# Altium schematic sheet final_sensor_sch_v3.SchDoc
size A2
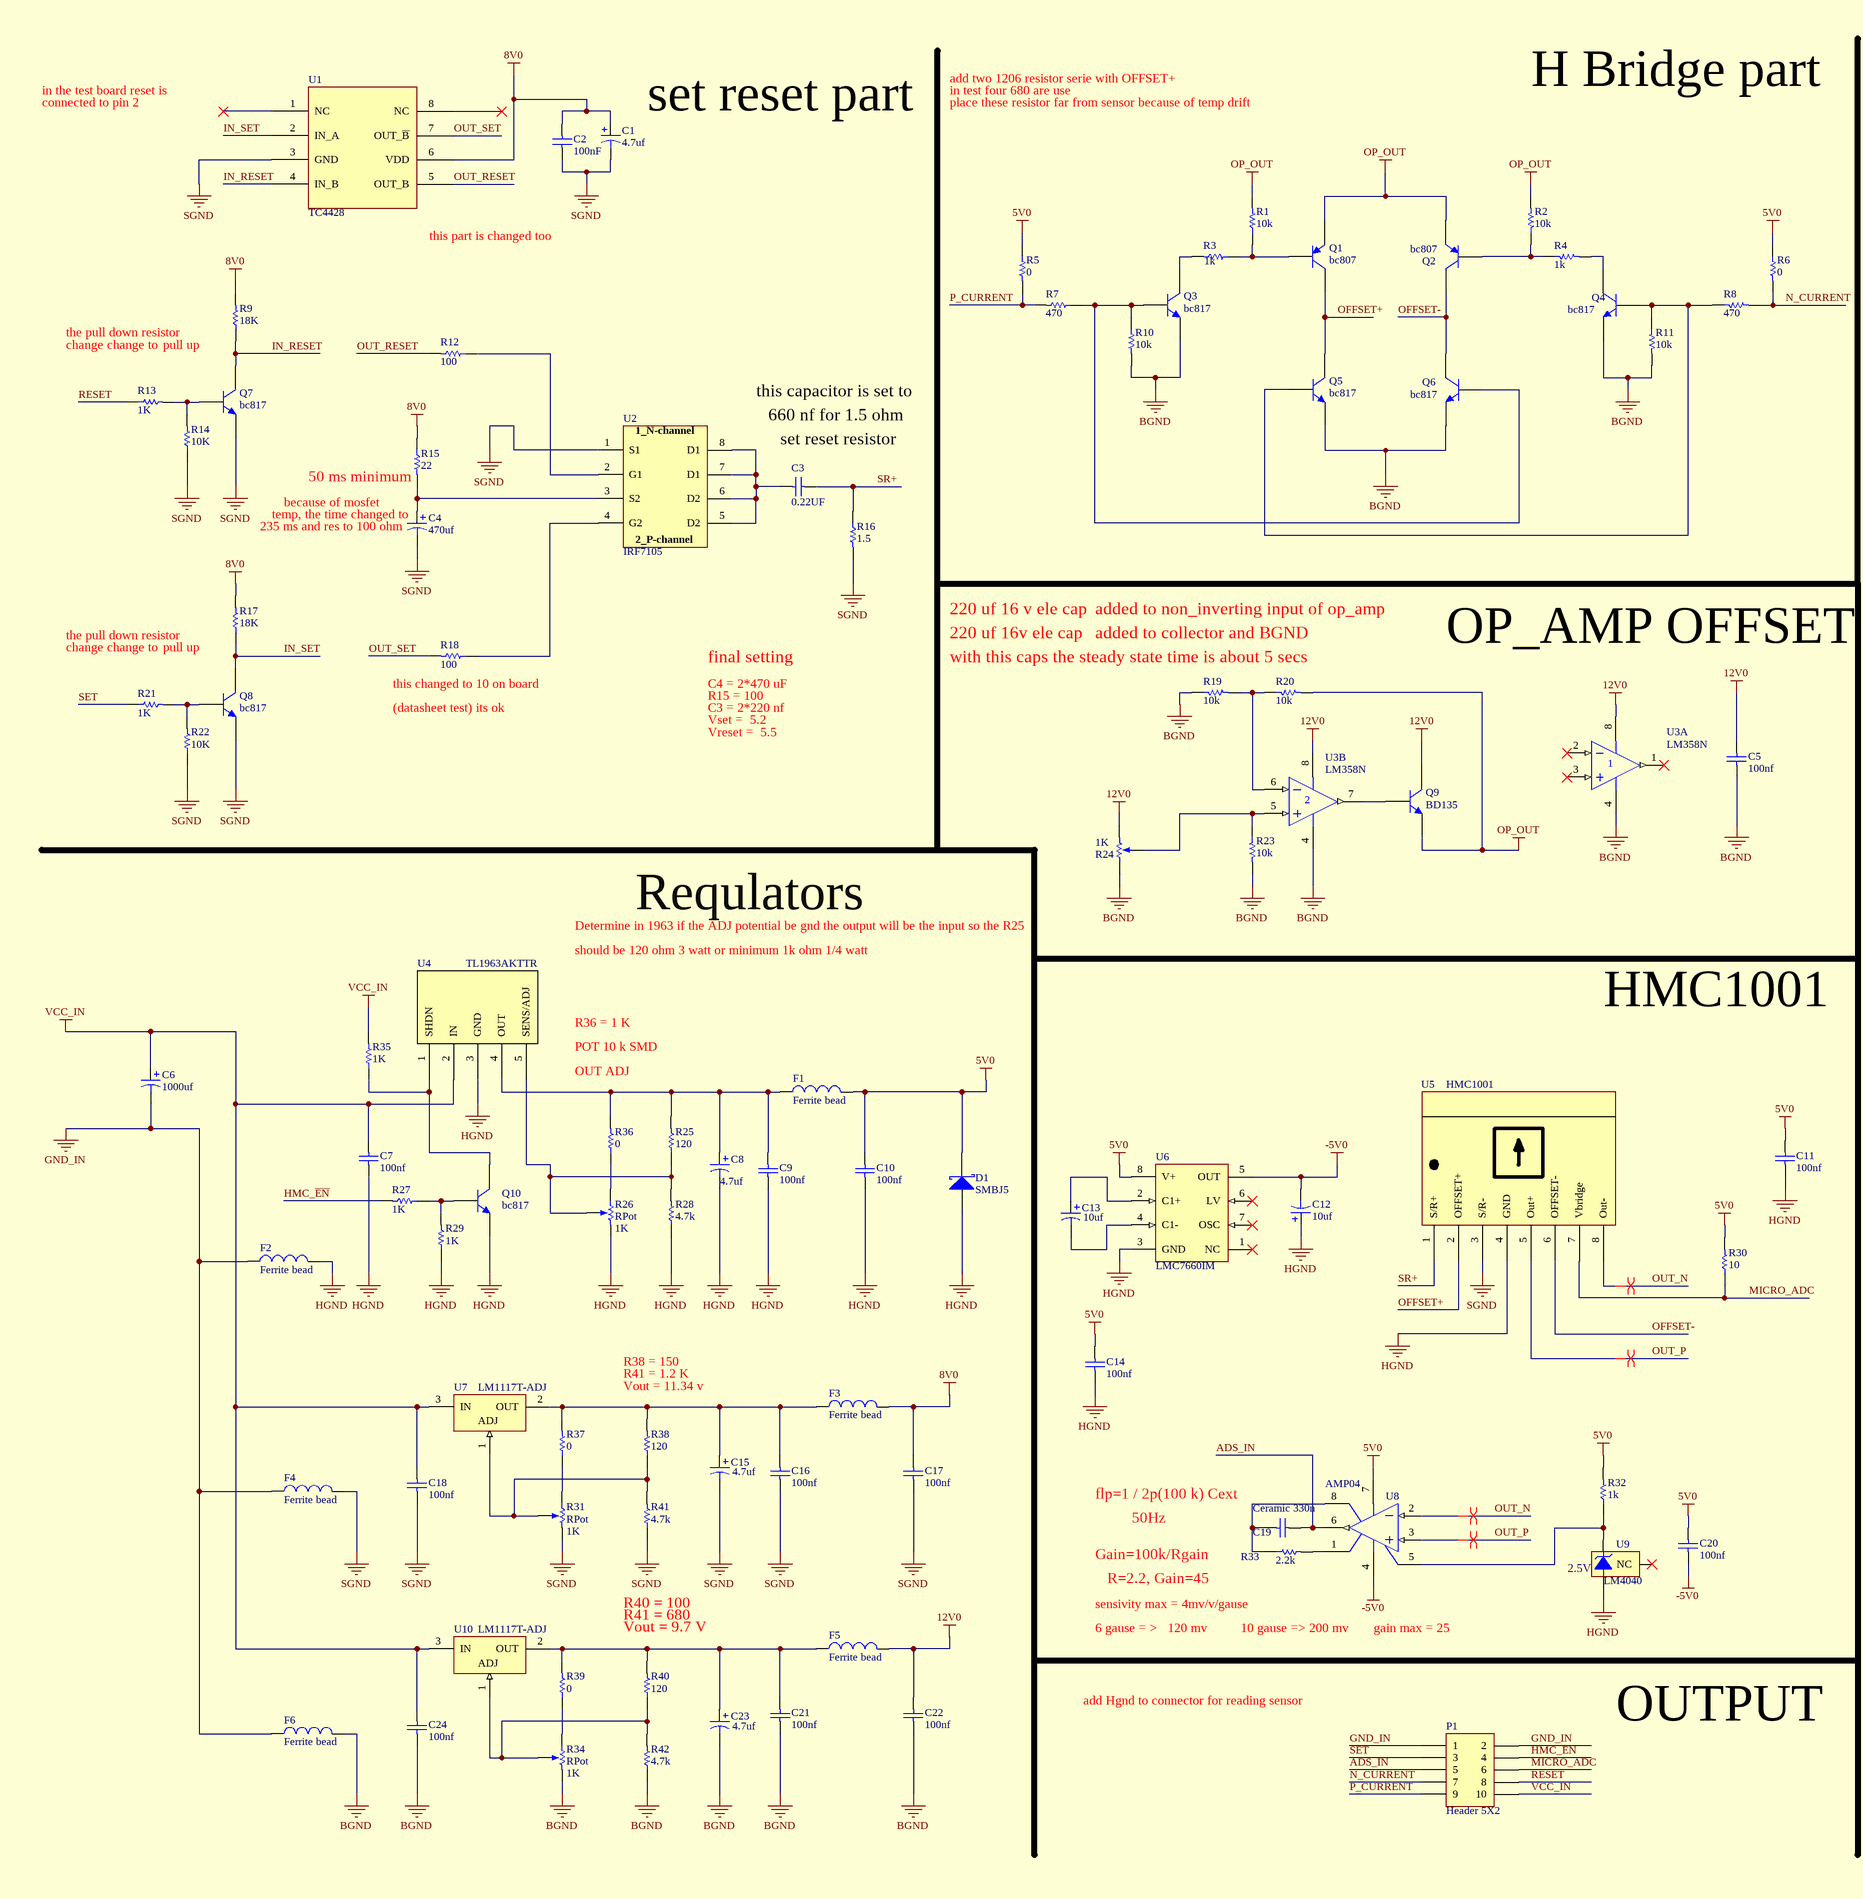
[diagram p0: final_sensor_sch_v3.SchDoc, left]
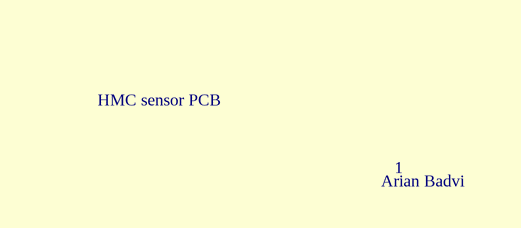
[diagram p1: final_sensor_sch_v3.SchDoc, right]

## Parts
C1  4.7uf  [cap_smd_a]
C2  100nF  [1206]
C3  0.22UF  [1206]
C4  470uf  [cap_smd_d]
C5  100nf  [1206]
C6  1000uf  [c_cyl_smd]
C7  100nf  [1206]
C8  4.7uf  [cap_smd_a]
C9  100nf  [1206]
C10  100nf  [1206]
C11  100nf  [1206]
C12  10uf  [cap_smd_a]
C13  10uf  [cap_smd_a]
C14  100nf  [1206]
C15  4.7uf  [cap_smd_a]
C16  100nf  [1206]
C17  100nf  [1206]
C18  100nf  [1206]
C19  Ceramic 330n  [1206]
C20  100nf  [1206]
C21  100nf  [1206]
C22  100nf  [1206]
C23  4.7uf  [cap_smd_a]
C24  100nf  [1206]
D1  SMBJ5  [tvs]
F1  Ferrite bead  [1206]
F2  Ferrite bead  [1206]
F3  Ferrite bead  [1206]
F4  Ferrite bead  [1206]
F5  Ferrite bead  [1206]
F6  Ferrite bead  [1206]
P1  Header 5X2  [HDR2X5]
Q1  bc807  [sot-23]
Q2  bc807  [sot-23]
Q3  bc817  [sot-23]
Q4  bc817  [sot-23]
Q5  bc817  [sot-23]
Q6  bc817  [sot-23]
Q7  bc817  [sot-23]
Q8  bc817  [sot-23]
Q9  BD135  [sot-32]
Q10  bc817  [sot-23]
R1  10k  [1206]
R2  10k  [1206]
R3  1k  [1206]
R4  1k  [1206]
R5  0  [1206]
R6  0  [1206]
R7  470  [1206]
R8  470  [1206]
R9  18K  [1206]
R10  10k  [1206]
R11  10k  [1206]
R12  100  [1206]
R13  1K  [1206]
R14  10K  [1206]
R15  22  [1206]
R16  1.5  [1206]
R17  18K  [1206]
R18  100  [1206]
R19  10k  [1206]
R20  10k  [1206]
R21  1K  [1206]
R22  10K  [1206]
R23  10k  [1206]
R24  value 1K  [pot smd]  (hidden comment: RPot)
R25  120  [1206]
R26  RPot  value 1K  [pot smd]
R27  1K  [1206]
R28  4.7k  [1206]
R29  1K  [1206]
R30  10  [1206]
R31  RPot  value 1K  [pot smd]
R32  1k  [1206]
R33  2.2k  [1206]
R34  RPot  value 1K  [pot smd]
R35  1K  [1206]
R36  0  [1206]
R37  0  [1206]
R38  120  [1206]
R39  0  [1206]
R40  120  [1206]
R41  4.7k  [1206]
R42  4.7k  [1206]
U1  TC4428  [sop8]
U2  IRF7105  [sop8]
U3  LM358N  [sop8]  (parts A,B of 2)
U4  TL1963AKTTR  [tl1963]
U5  HMC1001  [HMC1001]
U6  LMC7660IM  [sop8]
U7  LM1117T-ADJ  [dpak]
U8  AMP04  [sop8]
U9  LM4040  [sot-23]
U10  LM1117T-ADJ  [dpak]

## Nets
5V0: C10.2 C11.2 C14.2 C20.2 D1.2(K) F1.2 R5.1 R6.1 R30.2 R32.2 U6.8(V+) U8.7(V+)
8V0: C1.1 C2.1 C17.2 F3.2 R9.2 R15.1 R17.2 U1.6(VDD)
12V0: C5.2 C22.2 F5.2 Q9.2(C) R24.3(BOT) U3.8(V+)
-5V0: C12.2 C20.1 U6.5(OUT) U8.4(V-)
BGND: C5.1 C21.1 C22.1 C23.2 C24.1 F6.2 Q3.2(E) Q4.2(E) Q5.2(E) Q6.2(E) R10.2 R11.2 R19.1 R23.2 R24.1(TOP) R34.2(BOT) R42.1 U3.4(V-)
GND_IN: C6.2 F2.1 F4.1 F6.1 P1.1 P1.2
HGND: C7.1 C8.2 C9.1 C10.1 C11.1 C12.1 C14.1 D1.1(A) F2.2 Q10.2(E) R26.3(BOT) R28.1 R29.1 U4.3(GND) U5.4(GND) U6.3(GND) U9.2(-V)
OP_OUT: Q1.2(E) Q2.2(E) Q9.3(E) R1.2 R2.2 R20.2
SGND: C1.2 C2.2 C4.2 C15.2 C16.1 C17.1 C18.1 F4.2 Q7.2(E) Q8.2(E) R14.1 R16.2 R22.1 R31.2(BOT) R41.1 U1.3(GND) U2.1(S1) U5.3(S/R-)
VCC_IN: C6.1 C7.2 C18.2 C24.2 P1.10 R35.2 U4.2(IN) U7.3(IN) U10.3(IN)
ADS_IN: C19.1 P1.5 U8.6(OUT)
HMC_~{EN}: P1.4 R27.2
IN_RESET: Q7.3(C) R9.1 U1.4(IN_B)
IN_SET: Q8.3(C) R17.1 U1.2(IN_A)
MICRO_ADC: P1.6 R30.1 U5.7(Vbridge)
N_CURRENT: P1.7 R6.2 R8.2
OFFSET+: Q1.3(C) Q5.3(C) U5.2(OFFSET+)
OFFSET-: Q2.3(C) Q6.3(C) U5.6(OFFSET-)
OUT_N: U5.8(Out-) U8.2(IN-)
OUT_P: U5.5(Out+) U8.3(IN+)
OUT_RESET: R12.2 U1.5(OUT_B)
OUT_SET: R18.2 U1.7(OUT_~{B})
P_CURRENT: P1.9 R5.2 R7.2
RESET: P1.8 R13.1
SET: P1.3 R21.1
SR+: C3.2 R16.1 U5.1(S/R+)
NetC3_1: C3.1 U2.5(D2) U2.6(D2) U2.7(D1) U2.8(D1)
NetC4_1: C4.1 R15.2 U2.3(S2)
NetC8_1: C8.1 C9.2 F1.1 R25.2 R36.2 U4.4(OUT)
NetC13_1: C13.1 U6.2(C1+)
NetC13_2: C13.2 U6.4(C1-)
NetC15_1: C15.1 C16.2 F3.1 R37.2 R38.2 U7.2(OUT)
NetC19_2: C19.2 R33.1 U8.8(TAB)
NetC21_2: C21.2 C23.1 F5.1 R39.2 R40.2 U10.2(OUT)
NetQ1_1: Q1.1(B) R1.1 R3.1
NetQ2_1: Q2.1(B) R2.1 R4.1
NetQ3_1: Q3.1(B) Q6.1(B) R7.1 R10.1
NetQ3_3: Q3.3(C) R3.2
NetQ4_1: Q4.1(B) Q5.1(B) R8.1 R11.1
NetQ4_3: Q4.3(C) R4.2
NetQ7_1: Q7.1(B) R13.2 R14.2
NetQ8_1: Q8.1(B) R21.2 R22.2
NetQ9_1: Q9.1(B) U3.7(OUT)
NetQ10_1: Q10.1(B) R27.1 R29.2
NetQ10_3: Q10.3(C) R35.1 U4.1(SHDN)
NetR12_1: R12.1 U2.2(G1)
NetR18_1: R18.1 U2.4(G2)
NetR19_2: R19.2 R20.1 U3.6(IN-)
NetR23_1: R23.1 R24.2(TAP) U3.5(IN+)
NetR25_1: R25.1 R26.2(TAP) R28.2 U4.5(SENS/ADJ)
NetR26_1: R26.1(TOP) R36.1
NetR31_1: R31.1(TOP) R37.1
NetR31_3: R31.3(TAP) R38.1 R41.2 U7.1(ADJ)
NetR32_1: R32.1 U8.5(OS_NUL) U9.1(+V)
NetR33_2: R33.2 U8.1(OS_NUL)
NetR34_1: R34.1(TOP) R39.1
NetR34_3: R34.3(TAP) R40.1 R42.2 U10.1(ADJ)

Not connected (* = marked no-connect by the designer): U1 1(NC)* 8(NC)*; U3 1(OUT)* 2(IN-)* 3(IN+)*; U6 1(NC)* 6(LV)* 7(OSC)*; U9 3(NC)*

## Layout directives
differential pair: OUT_N, OUT_P

## Notes on the sheet
- in the test board reset is
- connected to pin 2
- add two 1206 resistor serie with OFFSET+
- in test four 680 are use
- place these resistor far from sensor because of temp drift
- H Bridge part
- (near C1) set reset part
- (near U1) this part is changed too
- (near R9) the pull down resistor
- change change to
- pull up
- this capacitor is set to
- 660 nf for 1.5 ohm
- (near C3) set reset resistor
- (near C4) 235 ms and res to 100 ohm
- (near C4) temp, the time changed to
- because of mosfet
- (near R15) 50 ms minimum
- (near R17) the pull down resistor
- 220 uf 16 v ele cap
- 220 uf 16v ele cap
- added to non_inverting input of op_amp
- added to collector and BGND
- OP_AMP OFFSET
- (near R18) this changed to 10 on board
- (near R18) (datasheet test) its ok
- C4 = 2*470 uF
- R15 = 100
- C3 = 2*220 nf
- final setting
- with this caps the steady state time is about 5 secs
- Vset =  5.2
- Vreset =  5.5
- Determine in 1963 if the ADJ potential be gnd the output will be the input so the R25
- should be 120 ohm 3 watt or minimum 1k ohm 1/4 watt
- Requlators
- HMC1001
- R36 = 1 K
- POT 10 k SMD
- OUT ADJ
- R38 = 150
- R41 = 1.2 K
- (near R38) Vout = 11.34 v
- (near C19) flp=1 / 2p(100 k) Cext
- Gain=100k/Rgain
- 50Hz
- R40 = 100
- R41 = 680
- sensivity max = 4mv/v/gause
- R=2.2, Gain=45
- (near U9) 2.5V
- (near R40) Vout = 9.7 V
- 6 gause = >
- 120 mv
- 10 gause => 200 mv
- gain max = 25
- add Hgnd to connector for reading sensor
- OUTPUT
- HMC sensor PCB
- Arian Badvi
- 1
- (in symbol IRF7106) 1_N-channel; 2_P-channel

## Library data of the parts
C1 C4 C8 C12 C13 C15 C23 = Cap Pol1: Polarized Capacitor (Radial); Published: 8-Jun-2000; LatestRevisionDate: 17-Jul-2002; LatestRevisionNote: Re-released for DXP Platform.; PackageReference: RB7.6-15; Publisher: Altium Limited; PackageDescription: Polarized Capacitor (Radial); 2 Leads
  C1 C8 C15 C23: Value: 4.7uf
  C4: Value: 470uf
  C12 C13: Value: 10uf
C2 C3 C5 C7 C9-C11 C14 C16-C18 C20-C22 C24 = Cap: Capacitor; Published: 8-Jun-2000; LatestRevisionDate: 17-Jul-2002; LatestRevisionNote: Re-released for DXP Platform.; PackageReference: RAD-0.3; Publisher: Altium Limited; PackageDescription: Radial Cap, Thru-Hole; 2 Leads; 0.3 in Pin Spacing
  C2: Value: 100nF
  C3: Value: 0.22UF
  C5 C7 C9-C11 C14 C16-C18 C20-C22 C24: Value: 100nf
C6 = Cap Pol1: electrolytic smd cap; Published: 8-Jun-2000; LatestRevisionDate: 17-Jul-2002; LatestRevisionNote: Re-released for DXP Platform.; PackageReference: RB7.6-15; Publisher: Altium Limited; PackageDescription: Polarized Capacitor (Radial); 2 Leads; Value: 1000uf
C19 = Cap: Capacitor; Value: 1n5; Published: 8-Jun-2000; LatestRevisionDate: 17-Jul-2002; LatestRevisionNote: Re-released for DXP Platform.; PackageReference: RAD-0.3; Publisher: Altium Limited; PackageDescription: Radial Cap, Thru-Hole; 2 Leads; 0.3 in Pin Spacing
D1 = Diode 10TQ040: tvs; Note: Terminal 2 is the TAB and is electrically connected to the cathode; Published: 8-Jun-2000; LatestRevisionDate: 17-Jul-2002; LatestRevisionNote: Re-released for DXP Platform.; DatasheetVersion: PD-2.057B; PackageVersion: Feb-1998; PackageReference: TO-220AC; Publisher: Altium Limited; ComponentLink1Description: Manufacturer Link; ComponentLink1URL: http://www.irf.com/
F1-F6 = Inductor: Ferrite bead, 1206; Code_IEC: 1005; Value: 10mH; Published: 8-Jun-2000; LatestRevisionDate: 29-May-2009; LatestRevisionNote: IPC-7351 Footprint Added.; PackageReference: 0402-A; Publisher: Altium Limited; PackageDescription: Chip Inductor; Code_JEITA: 0402
P1 = Header 5X2: Header, 5-Pin, Dual row; LatestRevisionDate: 17-Jul-2002; LatestRevisionNote: Re-released for DXP Platform.; Publisher: Altium Limited
Q1 Q2 = 2N3906: PNP General Purpose Amplifier; Published: 8-Jun-2000; LatestRevisionDate: 15-Jan-2003; LatestRevisionNote: PCB Footprint 'BCY-W3/D4.7' replaced; DatasheetVersion: 1997; PackageVersion: Sep-1998; PackageReference: TO-92A; Publisher: Altium Limited; Code_JEDEC: TO-92A; ComponentLink1Description: Manufacturer Link; ComponentLink1URL: http://www.fairchildsemi.com/; ComponentLink2Description: Datasheet; ComponentLink2URL: http://www.fairchildsemi.com/ds/2N%2F2N3906.pdf
Q3-Q10 = 2N3904: NPN General Purpose Amplifier; Published: 8-Jun-2000; LatestRevisionDate: 15-Jan-2003; LatestRevisionNote: PCB Footprint 'BCY-W3/D4.7' replaced; DatasheetVersion: 1997; PackageVersion: Sep-1998; PackageReference: TO-92A; Publisher: Altium Limited; ComponentLink1Description: Manufacturer Link; ComponentLink1URL: http://www.fairchildsemi.com/; ComponentLink2Description: Datasheet; ComponentLink2URL: http://www.fairchildsemi.com/ds/2N%2F2N3904.pdf
  Q3-Q6 Q9: Code_JEDEC: TO-92A
  Q7 Q8 Q10: PackageDescription: TO, Flat Index; 3 In-Line, Axial Leads; Body Dia. 4.5mm; Leads 0.51 x 0.48 mm (max)
R1-R23 R27 R29 R35 = Res1: Resistor; Published: 8-Jun-2000; LatestRevisionDate: 17-Jul-2002; LatestRevisionNote: Re-released for DXP Platform.; PackageReference: AXIAL-0.3; Publisher: Altium Limited; PackageDescription: Axial Device, Thru-Hole; 2 Leads; 0.3 in Pin Spacing
  R1 R2 R10 R11 R19 R20 R23: Value: 10k
  R3 R4: Value: 1k
  R5 R6: Value: 0
  R7 R8: Value: 470
  R9 R17: Value: 18K
  R12 R18: Value: 100
  R13 R21 R27 R29 R35: Value: 1K
  R14 R22: Value: 10K
  R15: Value: 22
  R16: Value: 1.5
R24 R26 R31 R34 = RPot: Potentiometer; Sim Note: Enter the Resistance value and the set point into parameter fields.; Set Position: 0.5; Published: 8-Jun-2000; LatestRevisionDate: 17-Jul-2002; LatestRevisionNote: Re-released for DXP Platform.; PackageReference: VR5; Publisher: Altium Limited
R25 R28 R30 R32 R36-R42 = Resistor: Resistor, 1/4W; Email: razi.vesali@gmail.com; Published: 17-Jun-2016; LatestRevisionNote: Re-released for puplic; Publisher: Seyed Razi Vesali
  R25 R38 R40: Value: 120
  R28 R41 R42: Value: 4.7k
  R30: Value: 10
  R32: Value: 1k
  R36 R37 R39: Value: 0
R33 = Resistor: General Resistor; Published: 8-Jun-2000; LatestRevisionDate: 17-Jul-2002; LatestRevisionNote: Re-released for DXP Platform.; PackageReference: AXIAL-0.3; Publisher: Altium Limited; PackageDescription: Axial Device, Thru-Hole; 2 Leads; 0.3 in Pin Spacing; Value: 2.2k
U2 = IRF7106
U3 = LM358N: Dual Low-Power Operational Amplifier; Published: 17-Jul-2002; LatestRevisionDate: 06-Jun-2005; LatestRevisionNote: Stylized 3D Model Added.; DatasheetVersion: 1988; PackageReference: 626-05; Publisher: Altium Limited; PackageDescription: DIP; 8 Leads; Row Spacing 7.62 mm; Pitch 2.54 mm; ComponentLink1Description: Manufacturer Link; ComponentLink1URL: http://www.onsemi.com/site/products/parametrics/0,4446,251,00.html; ComponentLink2Description: Datasheet; ComponentLink2URL: http://www.onsemi.com/pub/Collateral/LM358-D.PDF
U4 = TL1963
U6 = LMC7660IM: Switched Capacitor Voltage Converter; Manufacturer: National Semiconductor; CompType: Switch Caps; PackageTopMarking: NSZXTT*LMC76*60IM; PowerWise: N; Published: 4-Dec-2008; DatasheetVersion: Feb-2005; PackageVersion: revL, Sep-2006; PackageReference: M08A; Publisher: Altium Limited; PackageDescription: SOIC Narrow, 4.9 x 3.9 x 1.45mm, 8 Lead, 1.27mm Pitch; PartNumber: LMC7660IM; RoHS: O; PinCount: 8; DigiKeyPartNumber: LMC7660IM-ND; Code_JEDEC: MS-012-AA; Code_IPC: SOIC127P600-8; ComponentLink1Description: LMC7660 Datasheet; ComponentLink1URL: http://www.national.com/ds/LM/LMC7660.pdf; ComponentLink2Description: LMC7660 Web Page; ComponentLink2URL: http://www.national.com/pf/LM/LMC7660.html; ComponentLink3Description: M08A Package Page; ComponentLink3URL: http://www.national.com/packaging/folders/m08a.html
U7 U10 = LM1117T-ADJ: 800mA Low-Dropout Linear Regulator; Manufacturer: National Semiconductor; CompType: LDO IC; PackageTopMarking: NSUZXYTTE#*LM1117T*ADJ; PowerWise: N; Published: 4-Dec-2008; DatasheetVersion: Apr-2006; PackageVersion: revL, Jan-1992; PackageReference: T03B; Publisher: Altium Limited; PackageDescription: TO-220, Molded, 3 Lead, Straight; PartNumber: LM1117T-ADJ; RoHS: O; PinCount: 3; DigiKeyPartNumber: LM1117T-ADJ-ND; ComponentLink1Description: LM1117 Datasheet; ComponentLink1URL: http://www.national.com/ds/LM/LM1117.pdf; ComponentLink2Description: LM1117 Web Page; ComponentLink2URL: http://www.national.com/pf/LM/LM1117.html; ComponentLink3Description: T03B Package Page; ComponentLink3URL: http://www.national.com/packaging/folders/t03b.html
U8 = Op Amp: Published: 8-Jun-2000; LatestRevisionDate: 17-Jul-2002; LatestRevisionNote: Re-released for DXP Platform.; DatasheetVersion: REV. B; PackageVersion: 1990; PackageReference: H-08A; Publisher: Altium Limited; PackageDescription: Can; 8 Leads; Pin Circle Dia. 5.08 mm; Lead Dia. 0.53 mm (max); ComponentLink1Description: Manufacturer Link; ComponentLink1URL: http://www.analog.com/
U9 = LM4040: Precision Micropower Shunt Voltage Reference, 3-pin SOT-23; PartNumber: LM4040DIM3-10.0; Manufacturer: National Semiconductor; PackageTopMarking: R0D*XTT; PowerWise: N; CompType: Voltage Reference IC; Published: 4-Dec-2008; DatasheetVersion: Apr-2005; PackageVersion: revB, Mar-2003; PackageReference: MF03A; Publisher: Altium Limited; PackageDescription: Molded SOT-23, .115 x .051 x .037in Body, 3 Lead, .075 in Pitch; RoHS: N; PinCount: 3; ComponentLink1Description: LM4040 Datasheet; ComponentLink1URL: http://www.national.com/ds/LM/LM4040.pdf; ComponentLink2Description: LM4040 Web Page; ComponentLink2URL: http://www.national.com/pf/LM/LM4040.html; ComponentLink3Description: MF03A Package Page; ComponentLink3URL: http://www.national.com/packaging/folders/mf03a.html